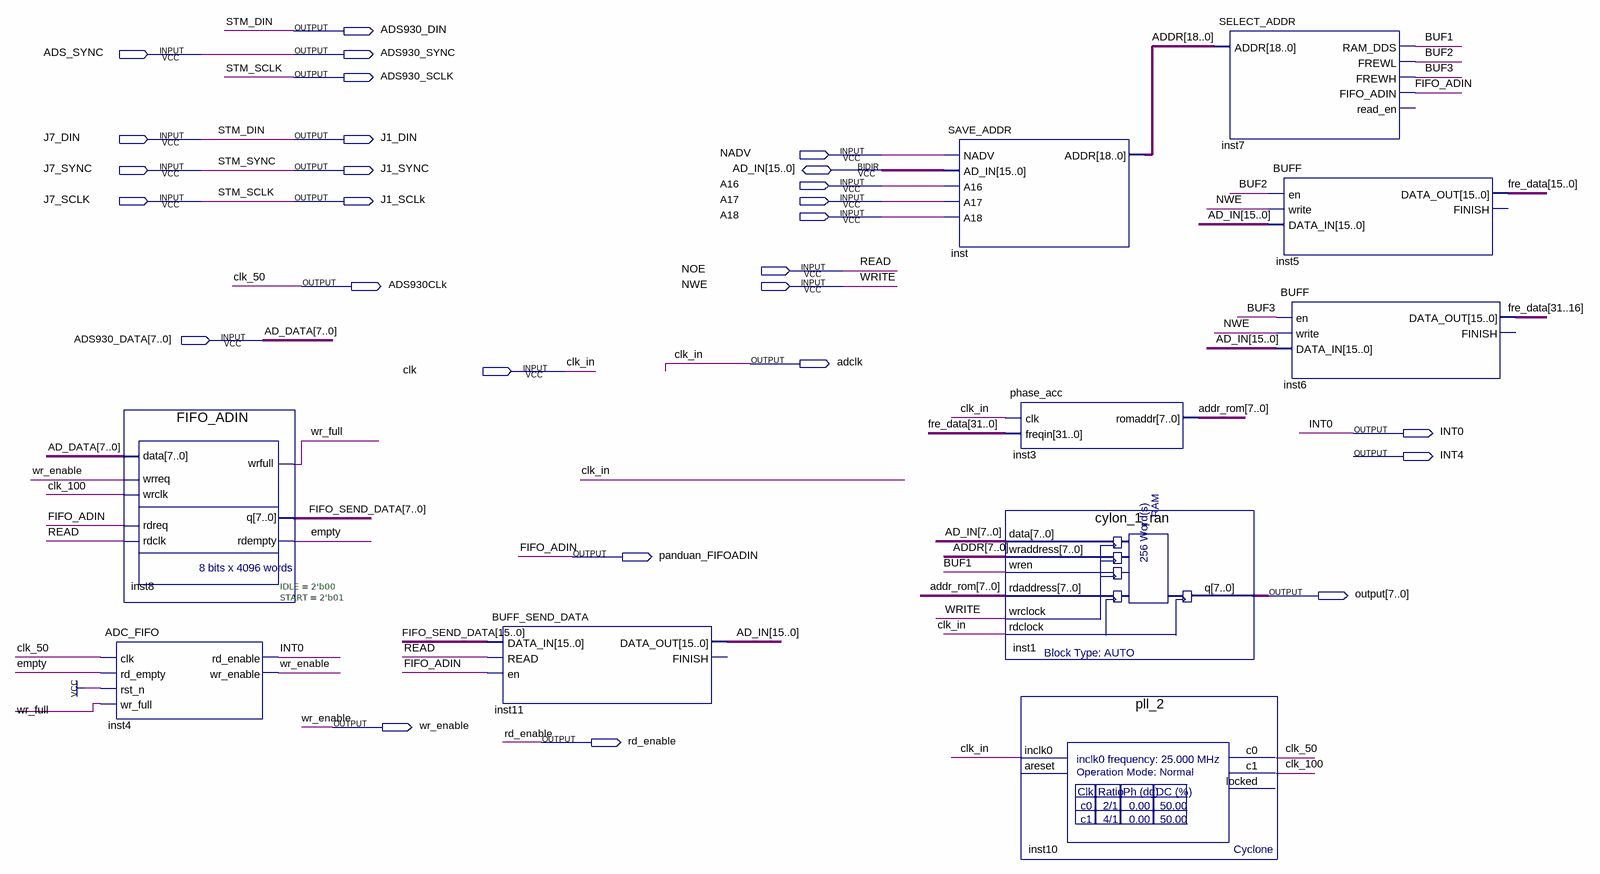
[diagram p0: schematic sheet]
// Quartus schematic FPGA_EP2C.bdf as structural Verilog: 10 symbols, 27 pins
module FPGA_EP2C (
  input  ADS_SYNC,
  input  J7_DIN,
  input  NADV,
  input  J7_SYNC,
  input  A16,
  input  J7_SCLK,
  input  A17,
  input  A18,
  input  NOE,
  input  NWE,
  input  [7:0] ADS930_DATA,
  input  clk,
  inout  [15:0] AD_IN,
  output ADS930_DIN,
  output ADS930_SYNC,
  output ADS930_SCLK,
  output J1_DIN,
  output J1_SYNC,
  output J1_SCLk,
  output ADS930CLk,
  output adclk,
  output INT0,
  output INT4,
  output panduan_FIFOADIN,
  output [7:0] \output ,
  output wr_enable,
  output rd_enable
);

  wire BUF1, BUF2, BUF3, clk_100, empty, wr_full;
  wire [7:0] addr_rom;
  wire [15:0] FIFO_SEND_DATA;
  wire [18:0] ADDR;
  wire [31:0] fre_data;

  FIFO_ADIN inst8 (
    .data(ADS930_DATA), .wrreq(wr_enable), .wrclk(clk_100), .rdreq(panduan_FIFOADIN), .rdclk(NOE),
    .wrfull(wr_full), .q(FIFO_SEND_DATA[7:0]), .rdempty(empty));
  ADC_FIFO #(.IDLE(2'b00), .START(2'b01)) inst4 (
    .clk(ADS930CLk), .rd_empty(empty), .rst_n(1'b1), .wr_full(wr_full), .rd_enable(INT0),
    .wr_enable(wr_enable));
  BUFF_SEND_DATA inst11 (
    .DATA_IN(FIFO_SEND_DATA), .READ(NOE), .en(panduan_FIFOADIN), .DATA_OUT(AD_IN));  // open: FINISH
  SAVE_ADDR inst (.NADV(NADV), .AD_IN(AD_IN), .A16(A16), .A17(A17), .A18(A18), .ADDR(ADDR));
  phase_acc inst3 (.clk(clk), .freqin(fre_data), .romaddr(addr_rom));
  cylon_1_ran inst1 (
    .data(AD_IN[7:0]), .wraddress(ADDR[7:0]), .wren(BUF1), .rdaddress(addr_rom), .wrclock(NWE),
    .rdclock(clk), .q(\output ));
  pll_2 inst10 (.inclk0(clk), .c0(ADS930CLk), .c1(clk_100));  // open: areset, locked
  SELECT_ADDR inst7 (
    .ADDR(ADDR), .RAM_DDS(BUF1), .FREWL(BUF2), .FREWH(BUF3), .FIFO_ADIN(panduan_FIFOADIN));  // open: read_en
  BUFF inst5 (.en(BUF2), .write(NWE), .DATA_IN(AD_IN), .DATA_OUT(fre_data[15:0]));  // open: FINISH
  BUFF inst6 (.en(BUF3), .write(NWE), .DATA_IN(AD_IN), .DATA_OUT(fre_data[31:16]));  // open: FINISH

  assign adclk = clk;
  assign ADS930_DIN = J7_DIN;
  assign ADS930_SCLK = J7_SCLK;
  assign ADS930_SYNC = ADS_SYNC;
  assign J1_DIN = J7_DIN;
  assign J1_SCLk = J7_SCLK;
  assign J1_SYNC = J7_SYNC;

  // Other names for the same wires on the sheet: AD_DATA[7:0] = ADS930_DATA; clk_50 = ADS930CLk; clk_in = clk;
  //   FIFO_ADIN = panduan_FIFOADIN; READ = NOE; STM_DIN = J7_DIN; STM_SCLK = J7_SCLK; STM_SYNC = J7_SYNC; WRITE = NWE
endmodule
